# EAGLE design 2.2_128x32_OLED-SPI-DRO-FTDI-6 (EAGLE 8.2.2)
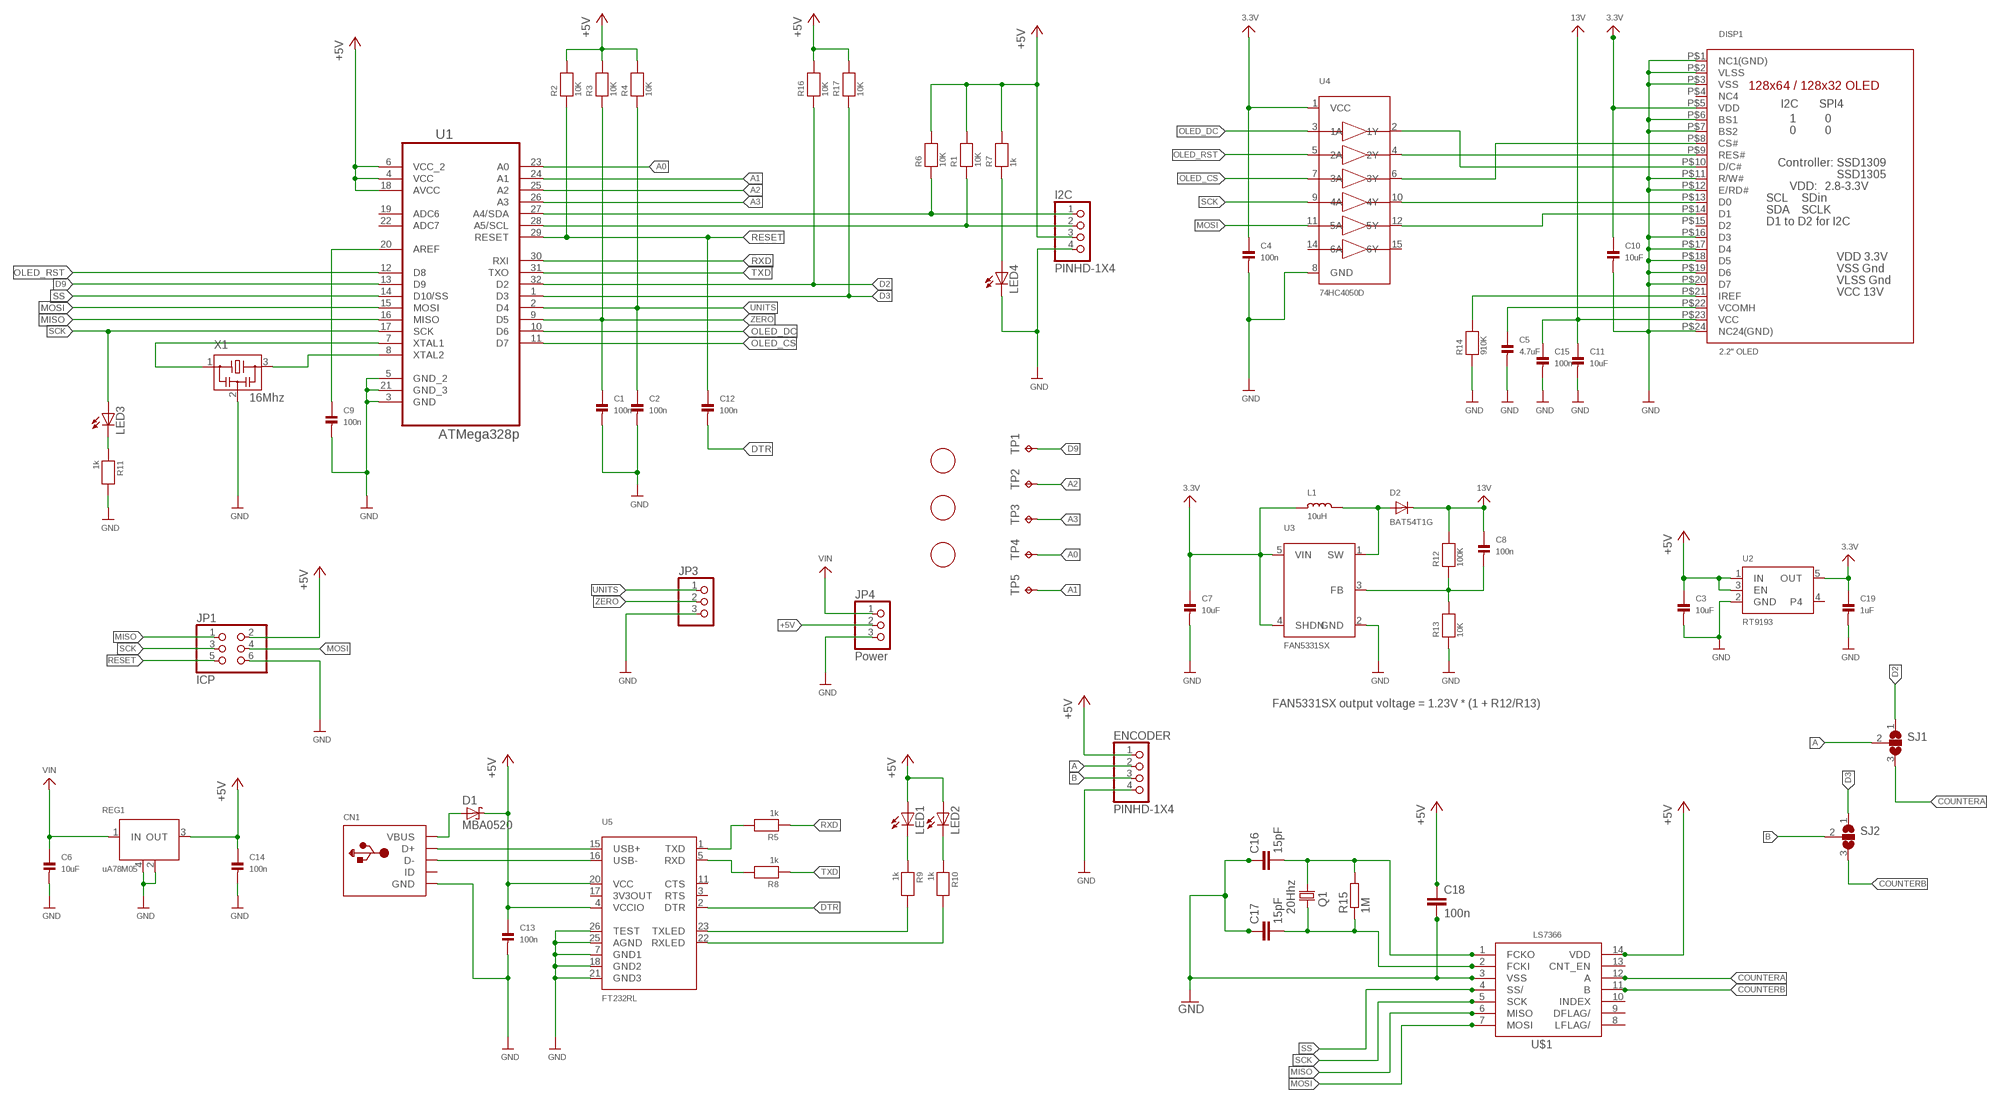
[diagram p0: schematic, sheet 1]

## Parts
C1  100n  CAP_CERAMIC0805  [0805]
C2  100n  CAP_CERAMIC0805  [0805]
C3  10uF  CAP_CERAMIC0805  [0805]
C4  100n  CAP_CERAMIC0805  [0805]
C5  4.7uF  CAP_CERAMIC0805  [0805]
C6  10uF  CAP_CERAMIC0805  [0805]
C7  10uF  CAP_CERAMIC0805  [0805]
C8  100n  CAP_CERAMIC0805  [0805]
C9  100n  CAP_CERAMIC0805  [0805]
C10  10uF  CAP_CERAMIC0805  [0805]
C11  10uF  CAP_CERAMIC0805  [0805]
C12  100n  CAP_CERAMIC0805  [0805]
C13  100n  CAP_CERAMIC0805  [0805]
C14  100n  CAP_CERAMIC0805  [0805]
C15  100n  CAP_CERAMIC0805  [0805]
C16  15pF  C-EUC0805  [C0805]
C17  15pF  C-EUC0805  [C0805]
C18  100n  C-EUC0805  [C0805]
C19  1uF  CAP_CERAMIC0805  [0805]
CN1  USBMINIB  [USB-MINIB]
D1  MBA0520  MBR0520  [SOD123]
D2  BAT54T1G  DIODESOD-123  [SOD-123]
DISP1  2.2" OLED  1.5-128X64-OLED  [1.5-128X64-TOP-CONTACT]
ENCODER  PINHD-1X4  [1X04-BIG]
I2C  PINHD-1X4  [1X04-BIG]
JP1  ICP  PINHD-2X3  [2X03]
JP3  PINHD-1X3  [1X03]
JP4  Power  PINHD-1X3  [1X03]
L1  10uH  INDUCTOR  [INDUCTOR_1007]
LED1  LEDCHIPLED_0805  [CHIPLED_0805]
LED2  LEDCHIPLED_0805  [CHIPLED_0805]
LED3  LEDCHIPLED_0805  [CHIPLED_0805]
LED4  LEDCHIPLED_0805  [CHIPLED_0805]
Q1  20Hhz  F6-CRYSTAL  [F6-XTAL]
R1  10K  RESISTOR0805  [0805]
R2  10K  RESISTOR0805  [0805]
R3  10K  RESISTOR0805  [0805]
R4  10K  RESISTOR0805  [0805]
R5  1k  RESISTOR0805  [0805]
R6  10K  RESISTOR0805  [0805]
R7  1k  RESISTOR0805  [0805]
R8  1k  RESISTOR0805  [0805]
R9  1k  RESISTOR0805  [0805]
R10  1k  RESISTOR0805  [0805]
R11  1k  RESISTOR0805  [0805]
R12  100K  RESISTOR0805  [0805]
R13  10K  RESISTOR0805  [0805]
R14  910K  RESISTOR0805  [0805]
R15  1M  R-EU_M0805  [M0805]
R16  10K  RESISTOR0805  [0805]
R17  10K  RESISTOR0805  [0805]
REG1  uA78M05  UA78M05  [UA78M05]
SJ1  SJ2W  [SJ_2]
SJ2  SJ2W  [SJ_2]
TP1  TPTP08R  [TP08R]
TP2  TPTP08R  [TP08R]
TP3  TPTP08R  [TP08R]
TP4  TPTP08R  [TP08R]
TP5  TPTP08R  [TP08R]
U1  ATMega328p  ATMEGA328P-AU  [TQFP-32]
U2  RT9193  VREG_SOT23-5  [SOT23-5]
U3  FAN5331SX  FAN5331  [SOT23-5]
U4  74HC4050D  [SOIC16]
U5  FT232RL  FT232RLSSOP28  [SSOP28DB]
U$1  LS7366  [SO14]
U$2  FIDUCIAL  [FIDUCIAL_1MM]
U$6  FIDUCIAL  [FIDUCIAL_1MM]
U$28  FIDUCIAL  [FIDUCIAL_1MM]
X1  16Mhz  CSTCE-CRYSTAL-OSC  [CSTCE-CRYSTAL-OSC]

## Nets
3.3V: C4.1 C7.1 C10.1 C19.1 DISP1.P$5(VDD) L1.P$1 U2.5(OUT) U3.4(SHDN) U3.5(VIN) U4.1(VCC)
13V: C8.1 C11.1 C15.1 D2.C DISP1.P$23(VCC) R12.2
+5V: C3.1 C13.1 C14.1 C18.1 D1.C ENCODER.1 I2C.3 JP1.2 JP4.2 LED1.A LED2.A R1.2 R2.2 R3.2 R4.2 R6.2 R7.2 R16.2 R17.2 REG1.3(OUT) U1.4(VCC) U1.6(VCC_2) U1.18(AVCC) U2.1(IN) U2.3(EN) U5.4(VCCIO) U5.20(VCC) U$1.14(VDD)
A: ENCODER.2 SJ1.2
A0: TP4.TP U1.23(A0)
A1: TP5.TP U1.24(A1)
A2: TP2.TP U1.25(A2)
A3: TP3.TP U1.26(A3)
B: ENCODER.3 SJ2.2
COUNTERA: SJ1.3 U$1.12(A)
COUNTERB: SJ2.3 U$1.11(B)
CS: DISP1.P$8(CS#) U4.6(3Y)
D0: DISP1.P$13(D0) U4.10(4Y)
D1: DISP1.P$14(D1) U4.12(5Y)
D2: R16.1 SJ1.1 U1.32(D2)
D3: R17.1 SJ2.1 U1.1(D3)
D9: TP1.TP U1.13(D9)
DC: DISP1.P$10(D/C#) U4.2(1Y)
DTR: C12.2 U5.2(DTR)
GND: C1.2 C2.2 C3.2 C4.2 C5.2 C6.2 C7.2 C9.2 C10.2 C11.2 C13.2 C14.2 C15.2 C16.1 C17.1 C18.2 C19.2 CN1.GND DISP1.P$1(NC1(GND)) DISP1.P$2(VLSS) DISP1.P$3(VSS) DISP1.P$6(BS1) DISP1.P$7(BS2) DISP1.P$11(R/W#) DISP1.P$12(E/RD#) DISP1.P$16(D3) DISP1.P$17(D4) DISP1.P$18(D5) DISP1.P$19(D6) DISP1.P$20(D7) DISP1.P$24(NC24(GND)) ENCODER.4 I2C.4 JP1.6 JP3.3 JP4.3 LED4.C R11.2 R13.1 R14.1 REG1.2(COMMON1) REG1.4(COMMON2) U1.3(GND) U1.5(GND_2) U1.21(GND_3) U2.2(GND) U3.2(GND) U4.8(GND) U5.7(GND1) U5.18(GND2) U5.21(GND3) U5.25(AGND) U5.26(TEST) U$1.3(VSS) X1.2
MISO: JP1.1 U1.16(MISO) U$1.6(MISO)
MOSI: JP1.4 U1.15(MOSI) U4.11(5A) U$1.7(MOSI)
N$5: D2.A L1.P$2 U3.1(SW)
N$6: U1.7(XTAL1) X1.1
N$7: DISP1.P$21(IREF) R14.2
N$8: C8.2 R12.1 R13.2 U3.3(FB)
N$9: C5.1 DISP1.P$22(VCOMH)
N$10: U1.8(XTAL2) X1.3
N$11: C9.1 U1.20(AREF)
N$12: CN1.D+ U5.15(USB+)
N$13: CN1.D- U5.16(USB-)
N$14: CN1.VBUS D1.A
N$15: R5.2 U5.1(TXD)
N$16: R8.2 U5.5(RXD)
N$17: R9.2 U5.23(TXLED)
N$18: R10.2 U5.22(RXLED)
N$19: LED3.C R11.1
N$20: LED1.C R9.1
N$21: LED2.C R10.1
N$23: LED4.A R7.1
N$24: C16.2 Q1.P$2 R15.2 U$1.1(FCKO)
N$26: C17.2 Q1.P$1 R15.1 U$1.2(FCKI)
OLED_CS: U1.11(D7) U4.7(3A)
OLED_DC: U1.10(D6) U4.3(1A)
OLED_RST: U1.12(D8) U4.5(2A)
RES: DISP1.P$9(RES#) U4.4(2Y)
RESET: C12.1 JP1.5 R2.1 U1.29(RESET)
RXD: R5.1 U1.30(RXI)
SCK: JP1.3 LED3.A U1.17(SCK) U4.9(4A) U$1.5(SCK)
SCL: I2C.2 R1.1 U1.28(A5/SCL)
SDA: I2C.1 R6.1 U1.27(A4/SDA)
SS: U1.14(D10/SS) U$1.4(SS/)
TXD: R8.1 U1.31(TXO)
UNITS: C2.1 JP3.1 R4.1 U1.2(D4)
VIN: C6.1 JP4.1 REG1.1(IN)
ZERO: C1.1 JP3.2 R3.1 U1.9(D5)
Unconnected: CN1.ID DISP1.P$4(NC4) DISP1.P$15(D2) U1.19(ADC6) U1.22(ADC7) U2.4 U4.14(6A) U4.15(6Y) U5.3(RTS) U5.11(CTS) U$1.8(LFLAG/) U$1.9(DFLAG/) U$1.10(INDEX) U$1.13(CNT_EN)

## Notes on the sheet
- FAN5331SX output voltage = 1.23V * (1 + R12/R13)

## Power pins joined to a net without a drawn wire
3V3OUT: U5.17(3V3OUT)

## Library data of the parts
C1-C15 C19 = microbuilder:CAP_CERAMIC: Ceramic Capacitors 0402 - 0402 Surface Mount Capacitors 16pF 50V 5% [Digikey: 445-4899-2-ND] 18pF 50V 5% [Digikey: 490-1281-2-ND] 22pF 50V 5% [Digikey: 490-1283-2-ND] 68pF 50V 5% [Digikey: 490-1289-2-ND] 0.1uF 10V 10% [Digikey: 490-1318-2-ND] 1.0uF 6.3V 10% [Digikey: 490-1320-2-ND] 0603 - 0603 Surface Mount Capacitors 16 pF 50V 5% [Digikey: 445-5051-2-ND] 22 pF 50V [Digikey: PCC220ACVTR-ND] 33 pF 50V 5% [Digikey: 490-1415-1-ND] 56pF 50V 5% [Digikey: 490-1421-1-ND] 220pF 50V 5% [Digikey: 445-1285-1-ND] 680 pF 50V 2200 pF 50V 5% C0G [Digikey: 445-1297-1-ND] 5600 pF 100V 5% X7R [Digikey: 478-3711-1-ND] 0.1 µF 25V 10% [Digikey: PCC2277TR-ND] 0.22 µF 16V 10% X7R [Digikey: 445-1318-1-ND] 1.0 µF 25V 10% [Digikey: 445-5146-2-ND] 0603 - RF Specific 3pF 250V +/-0.1pF RF [Digikey: 712-1347-1-ND] 18 pF 250V 5% [Digikey: 478-3505-1-ND or 712-1322-1-ND] 56 pF 250V 5% C0G RF [Digikey: 490-4867-1-ND] 68 pF 250V RF [Digikey: 490-4868-1-ND] 0805 - 0805 Surface Mount Capacitors 220 pF 250V 2% RF Ceramic Capacitor [Digikey: 712-1398-1-ND] 1000 pF 50V 2% NP0 Ceramic Capacitor [Digikey: 478-3760-1-ND] 0.1 µF 25V 10% Ceramic Capacitor [Digikey: PCC1828TR-ND] 1.0 µF 16V 10% Ceramic Capacitor[Digikey: 490-1691-2-ND] 10.0 µF 10V 10% Ceramic Capacitor[Digikey: 709-1228-1-ND] 10.0 uF 16V 10% Ceramic Capacitor [Digikey: 478-5165-2-ND] 47 uF 6.3V 20% Ceramic Capacitor [Digikey: 587-1779-1-ND or 399-5506-1-ND] 1206 - 1206 Surface Mount Capacitors 47uF 10V 20% Ceramic Capacitor [Digikey: 490-5528-1-ND or 399-5508-1-ND or 445-6010-1-ND] 100uF 6.3V -20%, +80% Y5V Ceramic Capacitor (Digikey: 490-4512-1-ND, Mouser: 81-GRM31CF50J107ZE1L)
C16-C18 = resistor:C-EU: CAPACITOR, European symbol
CN1 = adafruit:USB: USB Connectors USBMINIB - Surface Mount Female Mini-B USB Connector 4UConnector: 06564 By microbuilder.eu Thru-hole RA Female Mini-B USB Connector 4UConnector: 18732 By ladyada.net
D1 = Peters:MBR0520
D2 = microbuilder:DIODE: Diode SMA Model Volts Amps Type Vf Vr Digikey # Notes SSA34-E3 40V 3A Schottky 480mV @ 3A 200uA @ 40V SSA34-E3/61TGITR-ND CDBA120-G 20V 1A Schottky 500mV @ 1A 500uA @ 20V 641-1014-6-ND REEL MBRA210 10V 2A Schottky 350mV @ 2A 700uA @ 10V MBRA210LT3 SOD-123 Model Volts Amps Type Vf Vr Order # Notes BAT54T1G 30V 200mA Schottky 800mV @ 200mA 2uA @ 25V BAT54T1GOSTR-ND B0530W 30V 500mA Schottky 430mV @ 500mA 130uA @ 30V B0530W-FDICT-ND REEL MBR120 1A 20V Schottky 340mV @ 1A MBR120VLSFT1GOSCT-ND SOD-323 Model Volts Amps Type Vf Vr Order # Notes PMEG2005EJ 20V 500mA Schottky 355mV @ 500mA 568-4110-1-ND ZLLS410 10V 570mA Schottky 380mV @ 570mA ZLLS410CT-ND 1N4148WS 75V 150mA Silicon/Simple 1V 1N4148WSFSCT-ND REEL SOD-523 Model Volts Amps Type Vf Vr Order # Notes BAT54XV2 30V 200mA Schottky 0.8V @ 100mA BAT54XV2CT-ND TB751S 30V 30mA Schottky RB751S-40TE61CT-ND SOT23-R/W (R = Solder Paste/Reflow Ovens, W = Hand-Soldering) Model Volts Amps Type Vf Vr Order # Notes BAT54FILM 40V 300mA Schottky 497-7162-1-ND
DISP1 = Peters:1.5-128X64-OLED: 128x64 / 128x32 OLED Display SSD130X controller
ENCODER I2C = adafruit:PINHD-1X4
JP1 = pinhead:PINHD-2X3: PIN HEADER
JP3 JP4 = adafruit:PINHD-1X3: PIN HEADER
L1 = microbuilder:INDUCTOR: Inductors 0603: 10nH Ceramic Inductor - microwire antenna/RF (Digikey: 712-1434-2-ND) 0805: 560nH Ceramic Inductor - RF (Digikey: 553-1047-1-ND) 270nH Ceramic Inductor - Q = 40@250MHz, +-5%, 1 Ohm DC Resistance (Digikey: 535-10506-2-ND) 1007 (2518 Metric) SMT: 10µH 10% 250mOhm 820mA 1007 Inductor (Digikey: 587-2189-1-ND) 22µH 10% 500mOhm 580mA 1007 Inductor (Digikey: 587-2190-1-ND) 47µH 10% 950mOhm 420mA 1007 Inductor (Digikey: 587-2191-1-ND) 47µH 5% 100mOhm 1A 1008 Inductor (Digikey: 732-1816-1-ND) 5.0x5.0mm (Taiyo Yuden NR5040 Series) 6.8µH 20% 2.3A 64mOhm Inductor (Digikey: 587-2374-2-ND) 5.0x5.0mm (TDK VLC5045 Series) 4.7µH 20% 3.3A 34mOhm Inductor (Digikey: 445-6526-1-ND) 6.8µH 20% 2.7A 46mOhm Inductor (Digikey: 445-6527-1-ND) 6.0x6.0mm (TDK VLC6045 Series) 4.7µH 20% 3.8A 27mOhm Inductor (Digikey: 445-6538-2-ND) 6.8µH 20% 3A 41mOhm Inductor (Digikey: 445-6540-1-ND) 6.2µH 30% 2.2A 45mOhm Inductor (Digikey: SRR5028-6R2YCT-ND) - Not TDK VLC6045 but footprint should match 6.0x6.0mm (TDK SLF6045 Series) 6.8uH 30% 2A 33mOhm Inductor (Digikey: 445-4572-1-ND, Mouser: 810-SLF645T6R8N2R0PF)
LED1-LED4 = adafruit:LED: LED OSRAM: - CHIPLED LG R971, LG N971, LY N971, LG Q971, LY Q971, LO R971, LY R971 LH N974, LH R974 LS Q976, LO Q976, LY Q976 LO Q996 - Hyper CHIPLED LW Q18S LB Q993, LB Q99A, LB R99A - SideLED LS A670, LO A670, LY A670, LG A670, LP A670 LB A673, LV A673, LT A673, LW A673 LH A674 LY A675 LS A676, LA A676, LO A676, LY A676, LW A676 LS A679, LY A679, LG A679 - Hyper Micro SIDELED® LS Y876, LA Y876, LO Y876, LY Y876 LT Y87S - SmartLED LW L88C, LW L88S LB L89C, LB L89S, LG L890 LS L89K, LO L89K, LY L89K LS L896, LA L896, LO L896, LY L896 - TOPLED LS T670, LO T670, LY T670, LG T670, LP T670 LSG T670, LSP T670, LSY T670, LOP T670, LYG T670 LG T671, LOG T671, LSG T671 LB T673, LV T673, LT T673, LW T673 LH T674 LS T676, LA T676, LO T676, LY T676, LB T676, LH T676, LSB T676, LW T676 LB T67C, LV T67C, LT T67C, LS T67K, LO T67K, LY T67K, LW E67C LS E67B, LA E67B, LO E67B, LY E67B, LB E67C, LV E67C, LT E67C LW T67C LS T679, LY T679, LG T679 LS T770, LO T770, LY T770, LG T770, LP T770 LB T773, LV T773, LT T773, LW T773 LH T774 LS E675, LA E675, LY E675, LS T675 LS T776, LA T776, LO T776, LY T776, LB T776 LHGB T686 LT T68C, LB T68C - Hyper Mini TOPLED® LB M676 - Mini TOPLED Santana® LG M470 LS M47K, LO M47K, LY M47K Source: http://www.osram.convergy.de/
Q1 = Peters:F6-CRYSTAL
R1-R14 R16 R17 = microbuilder:RESISTOR: Resistors 0402 - 0402 Surface Mount Package 22 Ohm 1% 1/16W [Digikey: 311-22.0LRTR-ND] 33 Ohm 5% 1/16W 1.0K 5% 1/16W 1.5K 5% 1/16W 2.0K 1% 1/16W 10.0K 1% 1/16W [Digikey: 311-10.0KLRTR-ND] 10.0K 5% 1/16W [Digikey: RMCF0402JT10K0TR-ND] 12.1K 1% 1/16W [Digikey: 311-22.0LRTR-ND] 100.0K 5% 1/16W 0603 - 0603 Surface Mount Package 0 Ohm 1/10 Watt 1% Resistor 15 Ohm 1/10 Watt 1% Resistor 33 Ohm 1/10 Watt 1% Resistor 49.9 Ohm 1/10 Watt 1% Resistor 100 Ohm 1/10 Watt 1% Resistor 150 Ohm 1/10 Watt 1% Resistor 240 Ohm 1/10 Watt 1% Resistor 390 Ohm 1/10 Watt 1% Resistor 560 Ohm 1/10 Watt 1% Resistor 680 Ohm 1/10 Watt 1% Resistor 750 Ohm 1/10 Watt 1% Resistor 1.0K Ohm 1/10 Watt 1% Resistor 1.5K Ohm 1/10 Watt 1% Resistor 2.0K Ohm 1/10 Watt 1% Resistor 2.2K Ohm 1/10 Watt 1% Resistor 3.3K Ohm 1/10 Watt 1% Resistor 4.7K Ohm 1/10 Watt 1% Resistor 10.0K Ohm 1/10 Watt 1% Resistor 12.0K Ohm 1/10 Watt 1% Resistor 12.1K Ohm 1/10 Watt 1% Resistor 20.0K Ohm 1/10 Watt 1% Resistor 33.0K Ohm 1/10 Watt 1% Resistor 100.0K Ohm 1/10 Watt 1% Resistor 0805 - 0805 Surface Mount Package 0 Ohm 1/8 Watt 1% Resistor 33 Ohm 1/8 Watt 1% Resistor 100 Ohm 1/8 Watt 1% Resistor 150 Ohm 1/8 Watt 1% Resistor 200 Ohm 1/8 Watt 1% Resistor 240 Ohm 1/8 Watt 1% Resistor 330 Ohm 1/8 Watt 1% Resistor 390 Ohm 1/8 Watt 1% Resistor 470 Ohm 1/8 Watt 1% Resistor 1.0K Ohm 1/8 Watt 1% Resistor 1.5K Ohm 1/8 Watt 1% Resistor 2.0K Ohm 1/8 Watt 1% Resistor 4.7K Ohm 1/8 Watt 1% Resistor 5.1K Ohm 1/8 Watt 1% Resistor 5.6K Ohm 1/8 Watt 1% Resistor 10.0K Ohm 1/8 Watt 1% Resistor 22.0K Ohm 1/8 Watt 1% Resistor 33.0K Ohm 1/8 Watt 1% Resistor 100K Ohm 1/8 Watt 1% Resistor 1206 - 1206 Surface Mount Package 2012 - 2010 Surface Mount Package 0.11 Ohm 1/2 Watt 1% Resistor - Digikey: RHM.11UCT-ND
R15 = resistor:R-EU_: RESISTOR, European symbol
REG1 = Peters:UA78M05
SJ1 SJ2 = jumper:SJ2W: SMD solder JUMPER
TP1-TP5 = testpad:TP: Test pad
U1 = Peters:ATMEGA328P-AU
U2 = microbuilder:VREG_SOT23-5: SOT23-5 Fixed Voltage Regulators To better organise some of the SOT23-5 fixed voltage regulators in this library, this new part was created. Part Current Out V Out V In V Dropout Digikey Part No. ADP121 150mA 3.3V 3.4-5.5V 0.09V @ 150mA ADP121-AUJZ33R7CT-ND ADP121 150mA 3.0V 3.1-5.5V 0.09V @ 150mA ADP121-AUJZ30R7CT-ND ADP122 300mA 3.3V 3.4-5.5V 0.085V @ 300mA ADP122AUJZ-3.3-R7CT-ND ADP1712 300mA 3.3V 3.5-5.5V 0.17V @ 300mA ADP1712AUJZ-3.3-R7TR-ND AP7311 (Low Cost) 150mA 3.3V 3.5-6V 0.15V @ 150mA AP7311-33WG-7DICT-ND LD39015M18R 150mA 1.8V 1.9V-5.5V 0.08V @ 100mA 497-6977-1-ND MCP1824T-3302E/OT 300mA 3.3V 3.5V-6V 0.2V @ 300mA MCP1824T-3302E/OTCT-ND MIC5205-2.5YM5 TR 150mA 2.5V 2.7-16V 0.165V @ 150mA 576-1257-2-ND MIC5205-3.0YM5 TR 150mA 3.0V 3.2V-16V 0.165V @ 150mA 576-1258-2-ND MIC5205-3.3YM5 TR 150mA 3.3V 3.5V-16V 0.165V @ 150mA 576-1259-2-ND TPS780330220 150mA 3.3V+2.2V 3.6-5.5V 250mV Max 296-23332-1-ND TDA3663/N1,135 100mA 3.3V 3.5-45V 0.18V @ 50mA 568-5343-1-ND
U3 = microbuilder:FAN5331: FAN5331 - LED/OLED 20V Boost Converter Digikey: FAN5331SXCT-ND
U4 = microbuilder:74HC4050D: 6-channel level shifter 74HC4050D - 2V-6V Supply Digikey: 74HC4050D,653-ND Mouser: 771-74HC4050D-T
U5 = microbuilder:FT232RL: FTDI FT232RL USB TO RS232 Converter Digikey: 768-1007-1-ND
U$1 = LSI-2:LS7366: LS7366 32-Bit Quadrature Counter with SPI Interface
U$2 U$6 U$28 = adafruit:FIDUCIAL: For use by pick and place machines to calibrate the vision/machine, 1mm By microbuilder.eu
X1 = Peters:CSTCE-CRYSTAL-OSC: Murata CSTCE series Ceramic Resonator

## Board
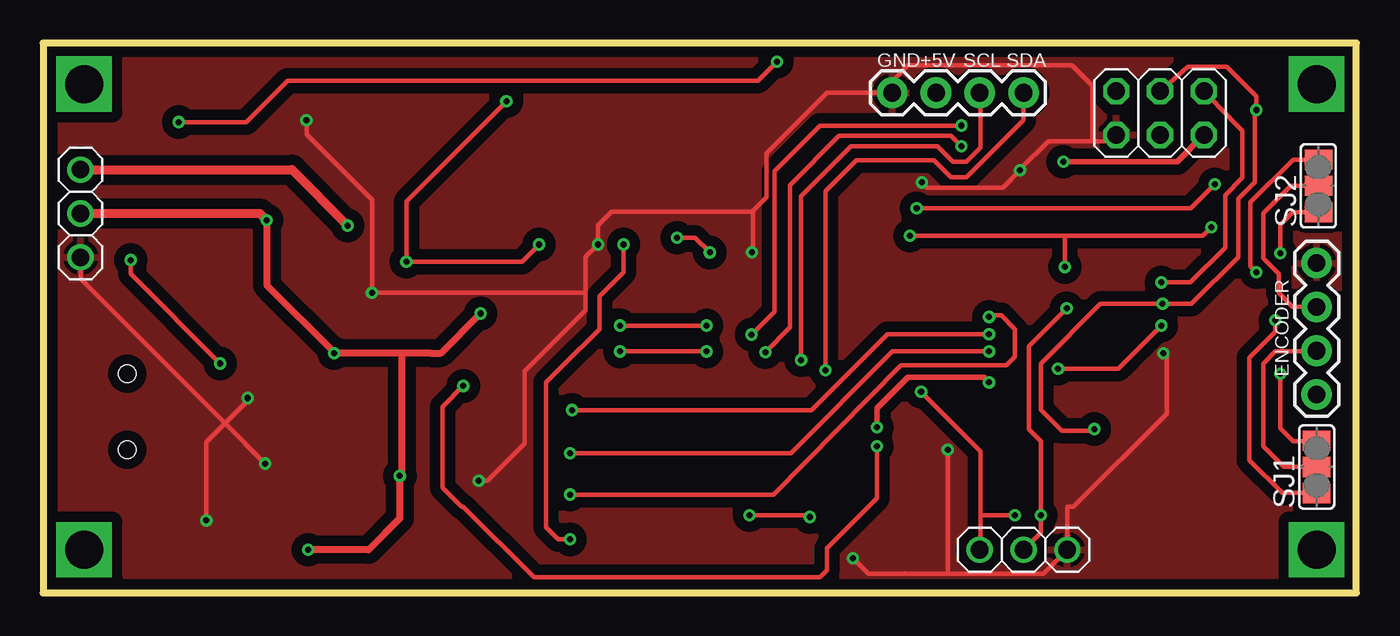
[diagram p1: board, top side]
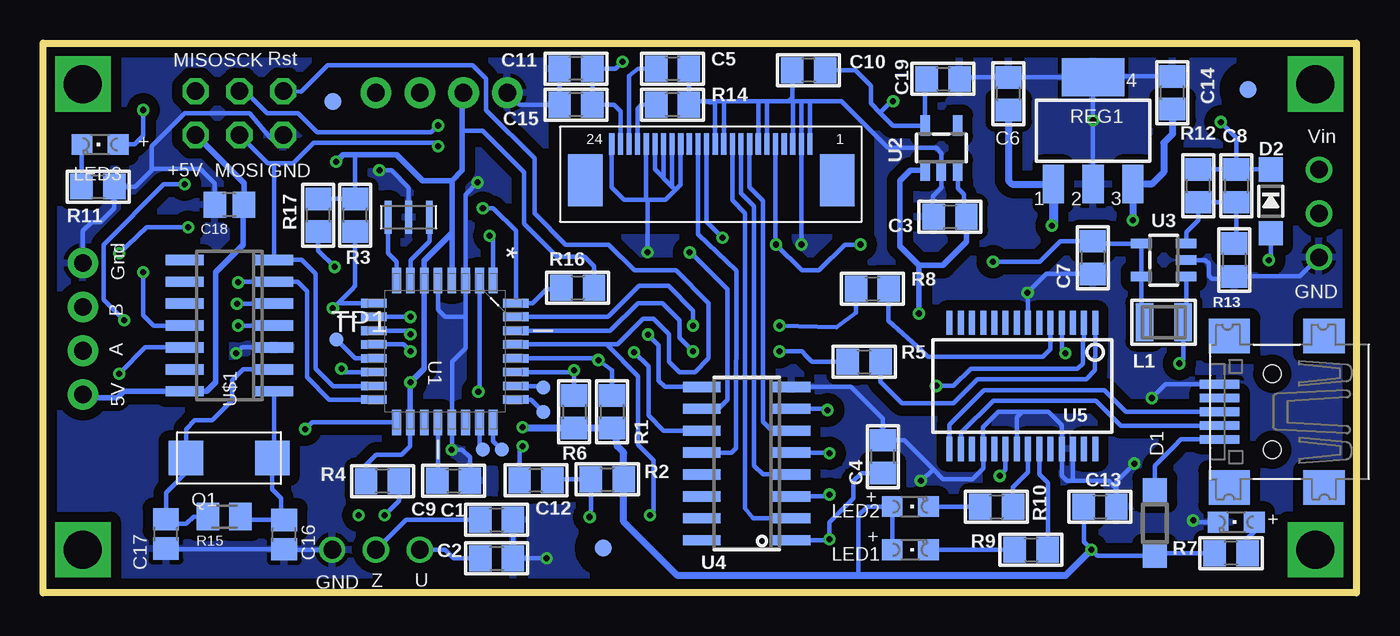
[diagram p2: board, bottom side, seen from below]

Size 76.18 x 31.88 mm. Coordinates in mm from the lower left corner, seen from the top.
Outline: 0,0 76.18,0 76.18,31.88 0,31.88 0,0
Copper layers (1*16): Top 0.0356mm / dielectric 1.5011mm / Bottom 0.0356mm
Design rules "LaenPCBOrder *": minimum track width 6mil, minimum drill 13mil, track to track 6mil, track to pad 6mil, pad to pad 6mil, via to via 6mil, smd to smd 6mil, copper to edge 15mil, drill to drill 6mil, minimum pad ring 7mil, minimum via ring 7mil, stop-mask expansion 3mil, vias tented up to drill 0mil, thermal gap 10mil

### Footprints (pad centres in the part's own frame; a part is rotated, then mirrored left to right if it is on the bottom)
0805 = smd 1.3 x 1.5: 1 -0.95,0; 2 0.95,0
C0805 = smd 1.3 x 1.5: 1 -0.85,0; 2 0.85,0
USB-MINIB = smd 0.5 x 2.308: D+ 0,4.064; D- -0.8,4.064; GND 1.6,4.064; ID 0.8,4.064; VBUS -1.6,4.064 | smd 2 x 2.4: GND1 -4.4,-2; GND2 -4.4,3.5; GND3 4.4,3.5; GND4 4.4,-2 | hole 1: -2.2,1; 2.2,1
SOD123 = smd 1.4 x 1.4: A 1.265,0; C -2.535,0
SOD-123 = smd 1.4 x 1.4: A 1.85,0; C -1.85,0
1.5-128X64-TOP-CONTACT = smd 0.3 x 1.25: P$1 11.5,0; P$2 11,0; P$3 10.5,0; P$4 10,0; P$5 9.5,0; P$6 9,0; P$7 8.5,0; P$8 8,0; P$9 7.5,0; P$10 7,0; P$11 6.5,0; P$12 6,0; P$13 5.5,0; P$14 5,0; P$15 4.5,0; P$16 4,0; P$17 3.5,0; P$18 3,0; P$19 2.5,0; P$20 2,0; P$21 1.5,0; P$22 1,0; P$23 0.5,0; P$24 0,0 | smd 2 x 3: P$25 -1.54,-2.1; P$26 13.08,-2.1
1X04-BIG = drill 1.016 pad 1.778: 1 0,0; 2 2.54,0; 3 5.08,0; 4 7.62,0
2X03 = drill 1.016 octagon: 1 -2.54,-1.27; 2 -2.54,1.27; 3 0,-1.27; 4 0,1.27; 5 2.54,-1.27; 6 2.54,1.27
1X03 = drill 1.016: 1 -2.54,0; 2 0,0; 3 2.54,0
INDUCTOR_1007 = smd 1.016 x 2.2: P$1 -1.127,0; P$2 1.127,0
CHIPLED_0805 = smd 1.2 x 1.2: A 0,-1.05; C 0,1.05
F6-XTAL = smd 2 x 2: P$1 -2.5,0; P$2 2.5,0
M0805 = smd 1.3 x 1.6: 1 -0.95,0; 2 0.95,0
UA78M05 = smd 1.219 x 2.235: 1 -2.311,-3.099; 2 0,-3.099; 3 2.311,-3.099 | smd 3.6 x 2.2: 4 0,3.099
SJ_2 = smd 1.168 x 1.6: 1 -1.524,0; 2 0,0; 3 1.524,0
TP08R = smd 0.8 x 0.8: TP 0,0
TQFP-32 = smd 1.473 x 0.508: 1 -4.115,2.794; 2 -4.115,2.007; 3 -4.115,1.194; 4 -4.115,0.406; 5 -4.115,-0.406; 6 -4.115,-1.194; 7 -4.115,-2.007; 8 -4.115,-2.794; 17 4.115,-2.794; 18 4.115,-2.007; 19 4.115,-1.194; 20 4.115,-0.406; 21 4.115,0.406; 22 4.115,1.194; 23 4.115,2.007; 24 4.115,2.794 | smd 0.508 x 1.473: 9 -2.794,-4.115; 10 -2.007,-4.115; 11 -1.194,-4.115; 12 -0.406,-4.115; 13 0.406,-4.115; 14 1.194,-4.115; 15 2.007,-4.115; 16 2.794,-4.115; 25 2.794,4.115; 26 2.007,4.115; 27 1.194,4.115; 28 0.406,4.115; 29 -0.406,4.115; 30 -1.194,4.115; 31 -2.007,4.115; 32 -2.794,4.115
SOT23-5 = smd 0.55 x 1.2: 1 -0.95,-1.3; 2 0,-1.3; 3 0.95,-1.3; 4 0.95,1.3; 5 -0.95,1.3
SOIC16 = smd 0.6 x 2.2: 1 -4.445,-2.6; 2 -3.175,-2.6; 3 -1.905,-2.6; 4 -0.635,-2.6; 5 0.635,-2.6; 6 1.905,-2.6; 7 3.175,-2.6; 8 4.445,-2.6; 9 4.445,2.6; 10 3.175,2.6; 11 1.905,2.6; 12 0.635,2.6; 13 -0.635,2.6; 14 -1.905,2.6; 15 -3.175,2.6; 16 -4.445,2.6
SSOP28DB = smd 0.348 x 1.397: 1 -4.225,-3.656; 2 -3.575,-3.656; 3 -2.925,-3.656; 4 -2.275,-3.656; 5 -1.625,-3.656; 6 -0.975,-3.656; 7 -0.325,-3.656; 8 0.325,-3.656; 9 0.975,-3.656; 10 1.625,-3.656; 11 2.275,-3.656; 12 2.925,-3.656; 13 3.575,-3.656; 14 4.225,-3.656; 15 4.225,3.656; 16 3.575,3.656; 17 2.925,3.656; 18 2.275,3.656; 19 1.625,3.656; 20 0.975,3.656; 21 0.325,3.656; 22 -0.325,3.656; 23 -0.975,3.656; 24 -1.625,3.656; 25 -2.275,3.656; 26 -2.925,3.656; 27 -3.575,3.656; 28 -4.225,3.656
SO14 = smd 0.6 x 2.2: 1 -3.81,-2.6; 2 -2.54,-2.6; 3 -1.27,-2.6; 4 0,-2.6; 5 1.27,-2.6; 6 2.54,-2.6; 7 3.81,-2.6; 8 3.81,2.6; 9 2.54,2.6; 10 1.27,2.6; 11 0,2.6; 12 -1.27,2.6; 13 -2.54,2.6; 14 -3.81,2.6
FIDUCIAL_1MM = smd 1 x 1: 1 0,0
CSTCE-CRYSTAL-OSC = smd 0.4 x 1.9: 1 -1.2,0; 2 0,0; 3 1.2,0

### Placement (x,y rotation side)
C1  49.87,4.24 0 bottom
C2  49.87,2 0 bottom
C3  23.57,21.8 180 bottom
C4  27.47,7.9 90 bottom
C5  39.67,30.4 0 bottom
C6  20.18,28.94 90 bottom
C7  15.29,19.44 270 bottom
C8  6.97,23.6 270 bottom
C9  52.37,6.5 0 bottom
C10  31.77,30.3 180 bottom
C11  45.27,30.4 180 bottom
C12  47.59,6.52 180 bottom
C13  14.87,5 0 bottom
C14  10.67,29 90 bottom
C15  45.27,28.3 180 bottom
C16  62.19,3.38 90 bottom
C17  69.05,3.42 90 bottom
C18  65.37,22.5 180 bottom
C19  23.97,29.8 0 bottom
CN1  3.87,10.5 90 bottom
D1  11.69,4.68 90 bottom
D2  4.97,22.7 270 bottom
DISP1  43.19,26.03 0 bottom
ENCODER  73.87,11.5 90 top
I2C  56.87,29 180 top
JP1  64.79,27.82 180 top
JP3  56.87,2.5 0 top
JP4  2.17,22 270 top
L1  11.17,15.7 0 bottom
LED1  25.87,2.5 270 bottom
LED2  25.87,5 270 bottom
LED3  72.87,26 90 bottom
LED4  6.97,4.1 90 bottom
Q1  65.39,7.82 0 bottom
R1  43.17,10.5 270 bottom
R2  43.45,6.58 0 bottom
R3  58.07,21.9 90 bottom
R4  56.49,6.48 180 bottom
R5  28.55,13.4 0 bottom
R6  45.37,10.5 270 bottom
R7  7.27,2.3 180 bottom
R8  28.07,17.64 0 bottom
R9  18.87,2.5 0 bottom
R10  20.87,5 0 bottom
R11  72.99,23.56 0 bottom
R12  9.17,23.6 90 bottom
R13  7.07,19.3 90 bottom
R14  39.67,28.3 180 bottom
R15  65.67,4.42 0 bottom
R16  45.17,17.7 0 bottom
R17  60.21,21.9 90 bottom
REG1  15.27,26.8 0 bottom
SJ1  73.87,7.3 90 top
SJ2  73.97,23.6 90 top
TP1  59.17,14.7 0 bottom
TP2  47.17,10.5 0 bottom
TP3  47.17,11.9 0 bottom
TP4  50.67,8.3 0 bottom
TP5  49.57,8.3 0 bottom
U1  52.87,14 270 bottom
U2  24.07,25.8 0 bottom
U3  11.17,19.3 90 bottom
U4  35.37,7.5 90 bottom
U5  19.37,12 180 bottom
U$1  65.37,15.5 90 bottom
U$2  6.27,29.2 0 bottom
U$6  59.37,28.5 0 bottom
U$28  43.67,2.6 0 bottom
X1  54.97,21.78 180 bottom

### Tracks (layer width: path | path; a pad name or v marks a point on that pad's centre or on a via)
3.3V  (via drill 0.35)
  Top 0.254: v30.57,3.1 29.87,3.1 29.17,3.8 29.17,12.2 30.07,13.1 30.08,13.1 32.27,15.29 32.27,17.2 33.67,18.6 v33.67,20.2 | v26.87,28.5 21.07,22.7 v21.07,19.2 27.77,19.2 v28.77,20.2
  Bottom 0.254: U4.1 30.62,3.06 v30.57,3.1 30.57,4.1 29.17,5.5 29.17,6.5 28.72,6.95 C4.1 | DISP1.P$5 33.69,20.22 v33.67,20.2 32.17,18.7 31.17,18.7 29.67,20.2 v28.77,20.2 | 27.62,27.85 26.87,27.1 U2.5 25.02,29.7 C19.1 | 27.62,27.85 28.17,28.4 28.17,29.4 29.07,30.3 C10.1 | 12.5,20.22 U3.4 | L1.P$1 12.47,15.87 U3.5 U3.4 | U3.4 15.15,20.25 C7.1 17.18,20.39 18.37,19.2 v21.07,19.2 | v26.87,28.5 26.98,28.5 27.62,27.85
13V  (via drill 0.35)
  Top 0.254: v42.57,30.8 41.47,29.7 14.19,29.7 11.79,27.3 v7.87,27.3
  Bottom 0.254: DISP1.P$23 42.69,27.92 43.07,28.3 C15.1 C11.1 42.97,30.4 v42.57,30.8 | R12.2 C8.1 | C8.1 D2.C | C8.1 6.97,26.4 v7.87,27.3
+5V  (via drill 0.35)
  Top 0.254: 16.87,13.95 v16.87,13.9 20.79,13.9 22.47,13.9 | v20.69,6.78 20.69,6.9 20.77,6.82 20.77,4.3 18.97,2.5 18.87,2.5
  Top 0.305: v59.17,25 65.78,25 JP1.2 | v48.37,9.6 48.37,10.7 50.17,12.5 54.57,12.5 v54.87,12.2
  Top 0.406: v12.97,21.6 12.97,17.85 16.87,13.95 | v16.87,13.9 22.47,13.9 23.07,13.9 v25.37,16.2 | 20.79,13.9 20.79,7 20.69,6.9 | v20.69,6.78 20.69,4.32 18.87,2.5 v15.37,2.5
  Top 0.508: JP4.2 12.57,22 v12.97,21.6
  Bottom 0.254: C13.1 15.82,2.95 v15.37,2.5 15.02,2.15 D1.C 11.44,2.3 R7.2 | LED1.A LED2.A 28.37,5 28.87,4.5 28.87,1 | 28.87,1 16.87,1 | U5.20 20.35,7.12 v20.69,6.78 | 28.87,1 39.37,1 | 42.5,6.48 R2.2 | 42.87,8.5 42.91,8.62 | R1.2 R6.2 45.54,9.55 48.32,9.55 | U1.18 54.88,8.49 55.37,8 56.87,8 57.44,7.43 R4.2 | 51.87,28.92 I2C.3 | C18.1 64.52,22.31 | v54.88,12.19 v54.87,12.2 54.87,12.31 | v59.17,25 59.07,24.9 | U2.3 23.12,23.45 22.77,23.1 22.77,21.95 C3.1 22.67,21.75 | U5.4 17.1,14.12 v16.87,13.9 | REG1.3 | 12.96,21.61 v12.97,21.6 | 58.17,25.34 58.12,25.4 58.07,25.36 R3.2 R17.2 | R16.2 44.22,18.95 44.77,19.5 46.37,19.5 48.27,21.4 48.27,24.39 49.57,25.69 49.57,25.7 50.67,26.8 51.78,26.8 51.87,26.71
  Bottom 0.305: 25.37,19 v25.37,16.2 | 25.37,19 26.47,20.1 26.47,23.9 25.87,24.5 U2.1 | U2.1 | C3.1 22.62,20.35 23.97,19 25.37,19 | U1.18 v54.88,12.19 54.07,13.01 U1.6 54.07,19.27 52.47,20.87 | 52.47,20.87 U1.4 | 52.47,20.87 52.47,23.91 | 52.47,23.91 51.87,24.5 51.87,26.71 51.87,28.92 | 52.47,23.91 54.18,23.91 55.67,25.4 58.12,25.4 58.77,25.4 v59.17,25 | JP1.2 64.52,23.74 C18.1 64.57,22.45 64.57,20.2 66.17,18.6 66.17,12.2 66.68,11.69 U$1.14 71.48,11.69 71.87,11.3 73.67,11.3 ENCODER.1
  Bottom 0.406: 12.96,21.61 REG1.3 11.87,23.7 11.17,24.4 11.17,26.1 10.67,26.6 C14.1 | v15.37,2.5 16.87,1 39.37,1 42.5,4.13 42.5,6.48 | R2.2 42.5,8.1 42.49,8.11 42.87,8.5 | 42.91,8.62 42.91,9.28 R1.2 45.54,9.55 | R6.2 48.32,9.55 v48.37,9.6
A
  Top 0.254: SJ1.2 71.97,7.3 70.77,8.5 70.77,13.3 71.47,14 73.83,14 ENCODER.2
  Bottom 0.254: 73.83,14 ENCODER.2
A0
  Bottom 0.254: U1.23 50.87,8.49 TP4.TP
A1
  Bottom 0.254: U1.24 50.08,8.81 TP5.TP
A2
  Bottom 0.254: U1.25 47.88,11.21 TP2.TP
A3
  Bottom 0.254: U1.26 47.27,11.99 TP3.TP
B
  Top 0.254: SJ2.2 72.37,23.6 70.77,22 70.77,19.4 71.67,18.5 71.67,17.4 72.47,16.6 73.85,16.6 ENCODER.3
COUNTERA  (via drill 0.35)
  Top 0.254: SJ1.3 73.85,8.8 72.52,8.8 71.77,9.55 v71.77,12.7
  Bottom 0.254: v71.77,12.7 71.7,12.78 70.25,14.23 U$1.12
COUNTERB  (via drill 0.35)
  Top 0.254: 73.95,25.1 SJ2.3 72.51,25.12 70.03,22.64 70.03,18.94 v70.37,18.6
  Bottom 0.254: U$1.11 69.77,15.5 70.37,16.1 v70.37,18.6
CS
  Bottom 0.254: DISP1.P$8 35.19,23.52 34.42,22.74 34.42,9.93 33.9,9.4 U4.6
D0  (via drill 0.35)
  Top 0.254: v36.77,20.6 37.81,20.6 v38.67,19.74
  Bottom 0.254: DISP1.P$13 37.69,21.52 v36.77,20.6 | v38.67,19.74 38.61,19.74 36.48,17.61 36.48,11.19 37,10.68 U4.10
D1
  Bottom 0.254: DISP1.P$14 38.19,20.79 35.95,18.67 35.99,8.4 36.26,8.13 U4.12
D2  (via drill 0.35)
  Top 0.254: v50.67,22.3 66.57,22.3 v67.97,23.7 | SJ1.1 73.85,5.8 71.87,5.8 69.97,7.7 69.97,13.63 71.47,15.13 v71.47,15.8
  Bottom 0.254: v50.67,22.3 50.07,22.3 48.76,20.98 U1.32 47.78,16.79 46.97,17.6 46.22,17.6 R16.1 | v67.97,23.7 69.17,23.7 72.67,20.2 72.67,17 v71.47,15.8
D3  (via drill 0.35)
  Top 0.254: SJ2.1 72.49,22.08 71.77,21.36 v71.77,19.7 | 59.25,20.7 v50.27,20.7 | 59.25,20.7 67.27,20.7 v67.77,21.2 | v59.27,18.9 59.27,20.68 59.25,20.7
  Bottom 0.254: U1.1 50.08,20.51 v50.27,20.7 | v67.77,21.2 70.17,21.2 v71.77,19.7 | R17.1 60.21,19.84 v59.27,18.9
D9
  Bottom 0.254: U1.13 58.07,13.59 TP1.TP
DC
  Bottom 0.254: U4.2 35,4.33 35.45,4.9 35.45,22.02 36.19,22.76 DISP1.P$10
DTR  (via drill 0.35)
  Top 0.254: v48.37,8.5 48.37,5.49 45.47,2.59 45.47,1.3 45.07,0.9 28.47,0.9 24.37,5 24.27,5 23.17,6.1 23.17,10.8 v24.37,12
  Bottom 0.254: U5.2 15.8,14.69 15.87,14.62 15.87,13.3 16.17,13 22.37,13 23.37,12 v24.37,12 | C12.2 48.54,8.33 v48.37,8.5
GND  (via drill 0.35)
  Top 0.254: 73.79,19.2 ENCODER.4 | 49.93,1.1 47.87,1.1 v46.97,2 | 52.46,1.1 49.93,1.1 | 52.46,1.1 58.01,1.1 JP3.3 59.41,5 59.77,5 65.17,10.4 65.17,13.7 v64.97,13.9 | 60.87,26.2 62.3,26.2 JP1.6 | 49.25,29.14 I2C.4 | 49.25,29.14 49.25,29.68 50.17,30.6 59.67,30.6 60.87,29.4 60.87,26.2 | 31.47,17.3 31.47,16.39 27.92,12.84 27.92,8.65 25.77,6.5 v25.27,6.5 | 31.47,17.3 31.47,19.48 v32.19,20.2 32.19,21.32 32.97,22.1 41.12,22.1 | v19.08,17.4 v19.07,17.4 | v19.08,17.4 31.38,17.4 31.47,17.3 | 10.55,9.82 v12.87,7.5 | v15.27,27.4 15.27,26.6 19.07,22.8 v19.07,17.41 v19.08,17.4 | 10.55,9.82 2.17,18.2 JP4.3 | v11.87,11.3 11.87,11.14 10.55,9.82 | 49.97,1.14 49.93,1.1 | v9.47,4.2 9.47,8.74 10.55,9.82 | 41.12,22.1 41.17,22.1 41.17,19.82 v41.11,19.76 | v50.97,23.8 51.27,23.5 55.67,23.5 v56.67,24.5 56.67,24.55 58.32,26.2 60.87,26.2 | 41.12,22.1 41.96,22.94 41.96,25.48 45.47,29 49.12,29 49.25,29.14 | v52.47,8.3 52.47,1.11 52.46,1.1
  Bottom 0.254: C13.2 13.92,6.05 | 13.92,6.05 14.37,6.5 16.4,6.5 | 16.4,6.5 16.79,6.5 17.1,6.8 U5.25 17.1,9.72 17.87,10.5 19.37,10.5 | U5.26 16.45,6.55 16.4,6.5 | CN1.GND 11.07,12.1 v11.87,11.3 | 13.92,6.05 13.92,6.45 v12.87,7.5 | 19.37,10.5 20.75,10.5 21.65,9.6 U5.18 21.65,7.22 22.27,6.6 23.97,6.6 24.55,7.18 | U5.21 19.7,10.18 19.37,10.5 | 51.68,15.91 U1.3 51.68,23.09 v50.97,23.8 | 51.68,15.91 51.68,14.19 52.47,13.41 U1.21 52.47,8.34 | 51.37,6.55 C9.2 51.42,7.85 51.87,8.3 52.42,8.3 52.47,8.34 | C1.2 C2.2 v46.97,2 | U1.5 53.28,16.41 52.87,16 51.77,16 51.68,15.91 | JP3.3 62.16,2.5 C16.1 69.01,2.53 C17.1 | 72.04,23.3 R11.2 70.83,23.56 69.87,24.52 | ENCODER.4 73.87,21 73.37,21.5 72.86,21.5 72.04,22.32 72.04,23.3 | 71.84,23.5 72.04,23.3 | U$1.3 64.64,14.23 v64.97,13.9 | 69.87,24.52 69.87,25.9 67.95,27.8 64.2,27.8 63.02,26.4 62.97,26.4 62.8,26.23 JP1.6 | X1.2 54.97,23.5 55.97,24.5 v56.67,24.5 | U4.8 29.32,11.95 27.47,10.1 C4.2 26.22,8.85 24.55,7.18 | DISP1.P$24 43.19,23.52 42.47,22.8 41.12,22.8 | 41.12,22.8 40.07,22.8 39.51,23.37 | DISP1.P$16 39.19,23.68 39.51,23.37 | 39.69,23.56 DISP1.P$17 | 39.69,23.56 39.51,23.37 | 40.19,24.06 DISP1.P$18 | 40.19,24.06 39.69,23.56 | DISP1.P$20 41.19,22.87 41.12,22.8 | DISP1.P$19 40.69,24.56 40.19,24.06 | 41.12,22.8 v41.12,19.77 v41.11,19.76 | v32.19,20.2 DISP1.P$2 32.19,28.48 32.17,28.5 | U5.7 19.05,17.38 v19.07,17.4 17.98,18.49 C7.2 | C11.2 C15.2 48.55,28.3 I2C.4 | 38.36,28.5 R14.1 C5.2 | 36.68,28.5 38.36,28.5 | 34.64,28.5 36.68,28.5 | 34.2,28.5 34.64,28.5 | 32.94,28.5 32.72,28.5 | 32.94,28.5 34.2,28.5 | 32.17,28.5 32.72,28.5 | 31.68,28.5 32.17,28.5 | 31.68,28.5 29.87,28.5 27.17,25.8 24.37,25.8 24.07,25.5 U2.2 24.07,23.5 24.57,23 24.57,21.85 C3.2
  Bottom 0.254: DISP1.P$12 37.19,28.43 38.36,28.5 | DISP1.P$11 36.69,28.49 36.68,28.5 | DISP1.P$7 34.69,28.45 34.64,28.5 | DISP1.P$6 34.19,28.5 34.2,28.5 | DISP1.P$3 32.69,28.48 32.72,28.5 | DISP1.P$1 31.69,28.49 31.68,28.5 | C10.2 32.72,28.71 32.94,28.5 | v25.27,6.5 25.23,6.5 24.55,7.18 | REG1.2 v15.27,27.4 15.27,29.77 | 15.27,29.77 REG1.4 20.17,29.9 C6.2 22.93,29.89 C19.2 | C14.2 15.1,29.95 15.27,29.77 | U3.2 8.77,19.3 8.57,19.1 8.57,18.4 8.37,18.2 7.22,18.2 R13.1 3.28,18.35 JP4.3 | LED4.C 9.37,4.1 v9.47,4.2 | C18.2 66.22,23.75 67.07,24.6 69.79,24.6 69.87,24.52 | 52.47,8.34 v52.47,8.31 v52.47,8.3
  pour Bottom (isolate 0.61): 0.47,31.5 27.77,31.5 27.77,20.6 47.07,20.6 47.07,31.5 75.57,31.5 75.57,0.3 0.47,0.3
  pour Top (isolate 0.61): 0.77,31.1 0.67,31.1 0.67,0.8 75.37,0.8 75.37,31.2 0.77,31.2
MISO  (via drill 0.35)
  Top 0.254: JP1.1 68.87,27.51 68.87,27.5 69.57,26.8 69.57,24.06 68.57,23.06 68.57,20.01 66.56,18 v64.87,18
  Bottom 0.254: U1.16 59.58,11.21 60.87,12.5 60.87,17.5 61.41,18.04 U$1.6 64.63,18.04 v64.87,18
MOSI  (via drill 0.35)
  Top 0.254: v53.27,25.9 52.67,26.5 46.17,26.5 43.32,23.65 43.32,15.39 v41.89,13.96
  Bottom 0.254: U1.15 59.37,11.99 60.37,13 60.37,18.5 61.18,19.31 U$1.7 62.77,24.3 | v41.89,13.96 41.07,13.14 41.07,10.3 40.18,9.4 U4.11 | 62.77,24.3 62.77,24.4 | 62.73,24.9 61.67,24.9 60.47,26.1 53.47,26.1 v53.27,25.9 | 62.73,24.9 63.14,24.9 JP1.4 | 62.77,24.3 62.77,24.85 62.73,24.9
N$1  (via drill 2.2)
  other vias: 2.37,2.5
N$2  (via drill 2.2)
  other vias: 73.87,2.5
N$3  (via drill 2.2)
  other vias: 2.37,29.5
N$4  (via drill 2.2)
  other vias: 73.87,29.5
N$5  (via drill 0.35)
  Top 0.254: v5.07,19.3 5.07,18.5 v10.27,13.3
  Bottom 0.254: U3.1 9.87,15.87 L1.P$2 10.05,13.53 v10.27,13.3 | D2.A 4.97,19.4 v5.07,19.3
N$6
  Bottom 0.254: X1.1 53.77,20.38 54.87,19.28 U1.7
N$7
  Bottom 0.254: DISP1.P$21 41.69,28.08 41.47,28.3 R14.2
N$8
  Bottom 0.254: U3.3 9.87,20.9 9.17,21.6 R12.1 C8.2 6.97,20.35 R13.2
N$9
  Bottom 0.254: DISP1.P$22 42.19,29.98 41.67,30.4 C5.1
N$10
  Bottom 0.254: U1.8 55.67,19.19 56.17,19.7 X1.3
N$11
  Bottom 0.254: U1.20 53.28,6.54 C9.1
N$12
  Bottom 0.254: U5.15 23.61,8.36 23.61,9.74 21.6,11.75 14.62,11.75 13.37,10.5 CN1.D+
N$13
  Bottom 0.254: U5.16 22.93,8.36 22.93,9.28 21.06,11.15 15.12,11.15 13.67,9.7 CN1.D-
N$14
  Bottom 0.254: CN1.VBUS 10.17,8.9 10.59,8.49 | 10.59,8.49 10.67,8.4 | D1.A 11.69,7.38 10.59,8.49
N$15
  Bottom 0.254: U5.1 15.15,13.72 15.17,13.7 15.17,12.9 15.67,12.4 21.97,12.4 23.37,11 26.37,11 27.6,12.23 R5.2
N$16
  Bottom 0.254: U5.5 17.75,14.12 18.17,13.7 24.85,13.7 25.2,14.05 26.3,15.03 27.14,15.79 R8.2
N$17
  Bottom 0.254: U5.23 18.4,6.88 17.89,6.38 17.89,2.53 R9.2
N$18
  Bottom 0.254: U5.22 19.05,7 19.93,6.12 R10.2
N$19
  Bottom 0.254: R11.1 73.94,25.98 LED3.C
N$20
  Bottom 0.254: R9.1 LED1.C
N$21
  Bottom 0.254: R10.1 LED2.C
N$23
  Bottom 0.254: LED4.A 5.92,3.55 6.37,3.1 6.37,2.35 R7.1
N$24
  Bottom 0.254: U$1.1 62.77,8.1 Q1.P$2 62.89,6.02 62.37,5.5 62.37,4.41 C16.2 64.53,4.23 R15.2
N$26
  Bottom 0.254: 68.79,6.08 67.89,6.98 Q1.P$1 67.87,9.5 67.37,10 66.37,10 65.2,11.17 65.2,12.33 64.56,12.96 U$1.2 | 68.79,6.08 68.87,6 | 68.79,6.08 69.05,5.82 C17.2 68.78,4 67.87,4 67.45,4.42 R15.1
OLED_CS  (via drill 0.35)
  Top 0.254: v30.67,10.6 44.57,10.6 48.97,15 v54.87,15
  Bottom 0.254: U1.11 55.07,15.19 v54.87,15 | U4.7 30.75,10.68 v30.67,10.6
OLED_DC  (via drill 0.35)
  Top 0.254: v30.57,5.7 42.37,5.7 49.77,13.2 55.87,13.2 56.37,13.7 56.37,15.3 55.57,16.1 54.97,16.1 v54.87,16
  Bottom 0.254: U1.10 v54.88,16.01 v54.87,16 | U4.3 30.68,5.59 v30.57,5.7
OLED_RST  (via drill 0.35)
  Top 0.254: v30.57,8.1 43.37,8.1 49.27,14 v54.87,14
  Bottom 0.254: U1.12 55.28,14.41 v54.87,14 | U4.5 30.61,8.13 v30.57,8.1
RES
  Bottom 0.254: DISP1.P$9 35.69,23.17 34.93,22.41 34.93,7.38 34.42,6.87 U4.4
RESET  (via drill 0.35)
  Top 0.254: v40.97,4.5 44.37,4.5 v44.47,4.4
  Bottom 0.254: C12.1 46.58,6.58 R2.1 44.4,4.47 v44.47,4.4 | v40.97,4.5 40.77,4.7 40.77,7.7 41.67,8.6 41.67,12.57 43.51,14.41 | JP1.5 61.2,29.07 59.67,30.6 51.25,30.6 50.47,29.82 50.47,27.99 47.67,25.19 47.67,22 45.87,20.2 43.37,20.2 41.87,18.7 39.47,18.7 37.57,16.8 37.57,13.6 38.37,12.8 39.27,12.8 39.87,13.4 39.87,15 40.77,15.9 41.37,15.9 42.87,14.41 43.51,14.41 | 43.51,14.41 U1.29
RXD  (via drill 0.35)
  Top 0.254: v33.47,14 v38.47,14
  Bottom 0.254: v38.47,14 39.27,14.8 39.27,15.82 40.26,16.8 41.68,16.8 43.28,15.19 U1.30 | R5.1 31.57,13.4 31.89,13.71 | 31.89,13.71 31.97,13.8 | v33.47,14 32.17,14 31.89,13.71
SCK  (via drill 0.35)
  Top 0.254: JP1.3 66.4,30.5 68.67,30.5 70.37,28.8 v70.37,28 70.27,27.9 70.27,23.81 69.32,22.85 69.32,19.47 66.61,16.76 v64.93,16.76 61.33,16.76 57.87,13.3 57.87,10.62 59.09,9.4 60.87,9.4 v60.97,9.5 | v41.09,14.98 42.42,16.31 42.42,24.45 45.07,27.1 v53.27,27.1
  Bottom 0.254: U$1.5 v64.92,16.77 v64.93,16.76 | LED3.A 70.87,26 70.37,26.5 v70.37,28 | U1.17 60.59,9.88 v60.97,9.5 | U4.9 40.12,11.95 40.47,12.3 40.47,14.36 v41.09,14.98 | JP1.3 64.46,29.09 63.17,27.8 61.37,27.8 60.28,26.71 53.67,26.71 v53.27,27.1
SCL  (via drill 0.35)
  Top 0.254: I2C.2 54.37,28.96 54.37,27.7 54.36,27.69 54.36,25.8 53.56,25 52.77,25 51.87,25.9 46.87,25.9 43.97,23 v43.97,13.5
  Bottom 0.254: R1.1 43.17,12.9 v43.97,13.5 44.07,13.59 U1.28
SDA  (via drill 0.35)
  Top 0.254: I2C.1 56.87,27.42 53.55,24.1 52.67,24.1 51.67,25.1 47.17,25.1 45.37,23.3 v45.37,12.9
  Bottom 0.254: 45.42,11.5 R6.1 45.37,12.84 | 45.37,12.84 v45.37,12.9 | U1.27 45.41,12.81 45.37,12.84
SS  (via drill 0.35)
  Top 0.254: v58.87,13 62.37,13 v64.87,15.5
  Bottom 0.254: U1.14 58.68,12.81 v58.87,13 | U$1.4 v64.87,15.5
TXD  (via drill 0.35)
  Top 0.254: v33.47,15.5 v38.47,15.5
  Bottom 0.254: 33.32,15.35 v33.47,15.5 30.17,15.4 29.02,16.25 R8.1 | v38.47,15.5 38.47,16.37 39.9,17.8 41.61,17.8 43.4,16.01 U1.31
UNITS  (via drill 0.35)
  Top 0.254: JP3.1 54.23,2.61 54.37,2.75 54.37,4.43 | 54.37,4.43 54.37,8.22 v50.93,11.66 | v56.37,4.5 54.44,4.5 54.37,4.43
  Bottom 0.254: C2.1 52.37,2 52.87,2.5 JP3.1 | R4.1 55.54,5.33 v56.37,4.5 | U1.2 50.87,11.89 v50.93,11.66
VIN  (via drill 0.35)
  Top 0.508: JP4.1 14.43,24.54 v17.67,21.3
  Bottom 0.254: C6.1
  Bottom 0.406: REG1.1 19.97,23.7 20.18,23.91 C6.1
  Bottom 0.508: REG1.1 17.58,21.39 v17.67,21.3
ZERO  (via drill 0.35)
  Top 0.254: JP3.2 57.87,3.5 v57.87,4.5 57.87,8.8 57.17,9.5 57.17,14.3 v59.37,16.5
  Bottom 0.254: C1.1 55.13,4.24 JP3.2 | U1.9 59.08,16.79 | v59.37,16.5 59.08,16.79 | 58.27,17.61 58.17,17.7 | 58.27,17.61 59.08,16.79 | R3.1 58.07,17.8 58.27,17.61

### Text on the board
tNames: GND | +5V | SCL | SDA
bNames: Rst | SCK | MISO | Vin | + | GND | MOSI | +5V | Gnd | GND | B | A | 5V | + | + | + | U | Z | GND